# EAGLE design programmer (EAGLE 7.5.0)
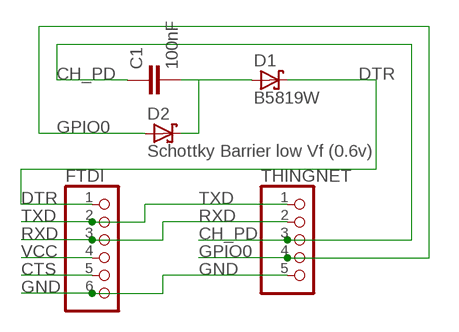
[diagram p0: schematic, sheet 1]

## Parts
C1  100nF  C-EU025-024X044  [C025-024X044]
D1  B5819W  SCHOTTKY-DIODEDO35-7  [DO35-7]
D2  Schottky Barrier low Vf (0.6v)  SCHOTTKY-DIODEDO35-7  [DO35-7]
FTDI  PINHD-1X6  [1X06]
THINGNET  PINHD-1X5  [1X05]

## Nets
CH_PD: C1.1 THINGNET.3
CTS: FTDI.5
DTR: D1.C FTDI.1
GND: FTDI.6 THINGNET.5
GPIO0: D2.A THINGNET.4
N$1: C1.2 D1.A D2.C
RXD: FTDI.3 THINGNET.2
TXD: FTDI.2 THINGNET.1
VCC: FTDI.4

## Library data of the parts
C1 = rcl:C-EU: CAPACITOR, European symbol
D1 D2 = diode:SCHOTTKY-DIODE: Schottky Diode
FTDI = pinhead:PINHD-1X6: PIN HEADER
THINGNET = pinhead:PINHD-1X5: PIN HEADER

## Board
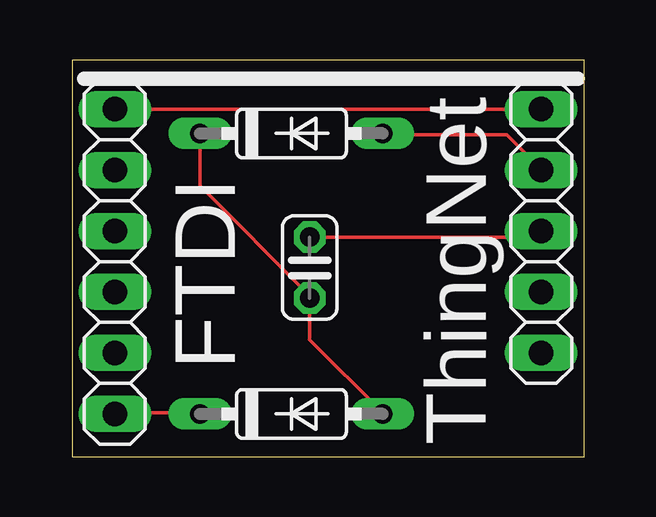
[diagram p1: board, top side]
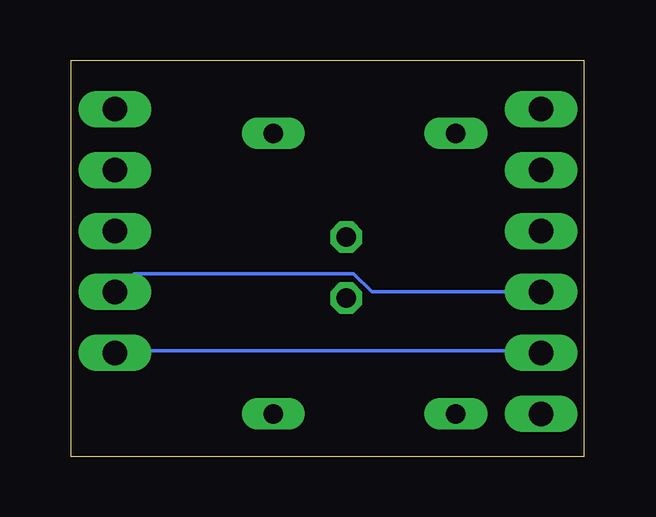
[diagram p2: board, bottom side, seen from below]

Size 21.37 x 16.52 mm. Coordinates in mm from the lower left corner, seen from the top.
Outline: 0,0 21.37,0 21.37,16.52 0,16.52 0,0
Copper layers (1*16): Top 0.035mm / dielectric 1.5mm / Bottom 0.035mm
Design rules "SeeedStudio_2layer_DRU_no_angle_20140221": minimum track width 6mil, minimum drill 12mil, track to track 6mil, track to pad 6mil, pad to pad 6mil, via to via 6mil, smd to smd 0mil, copper to edge 10mil, drill to drill 10mil, minimum pad ring 10mil, minimum via ring 6mil, stop-mask expansion 2mil, vias tented up to drill 100mil, thermal gap 10mil

### Footprints (pad centres in the part's own frame; a part is rotated, then mirrored left to right if it is on the bottom)
C025-024X044 = drill 0.813 octagon: 1 -1.27,0; 2 1.27,0
DO35-7 = drill 0.813 long: A 3.81,0; C -3.81,0
1X06 = drill 1.016 long: 1 -6.35,0; 2 -3.81,0; 3 -1.27,0; 4 1.27,0; 5 3.81,0; 6 6.35,0
1X05 = drill 1.016 long: 1 -5.08,0; 2 -2.54,0; 3 0,0; 4 2.54,0; 5 5.08,0

### Placement (x,y rotation side)
C1  9.91,7.87 270 top
D1  9.14,1.78 0 top
D2  9.14,13.46 0 top
FTDI  1.78,8.13 90 top
THINGNET  19.56,9.4 90 top

### Tracks (layer width: path | path; a pad name or v marks a point on that pad's centre or on a via)
CH_PD
  Top 0.152: C1.1 19.36,9.14 19.51,9.3 THINGNET.3
DTR
  Top 0.152: D1.C 5.33,1.83 1.83,1.83 FTDI.1
GND
  Top 0.152: THINGNET.5 FTDI.6
GPIO0
  Top 0.152: D2.A 12.95,13.41 18.14,13.41 19.51,12.04 THINGNET.4
N$1
  Top 0.152: D1.A 12.95,1.83 9.91,4.88 C1.2 9.91,6.71 5.33,11.28 D2.C
RXD
  Bottom 0.152: FTDI.3 8.84,6.86 9.6,7.62 18.75,7.62 19.51,6.86 THINGNET.2
TXD
  Bottom 0.152: FTDI.2 1.83,4.42 19.51,4.42 THINGNET.1

### Text on the board
tNames: ThingNet